# Altium schematic sheet TopLevel.SchDoc
size A3; DrawnBy: Fredrik Skavlem; SheetNumber: 1; SheetTotal: 8
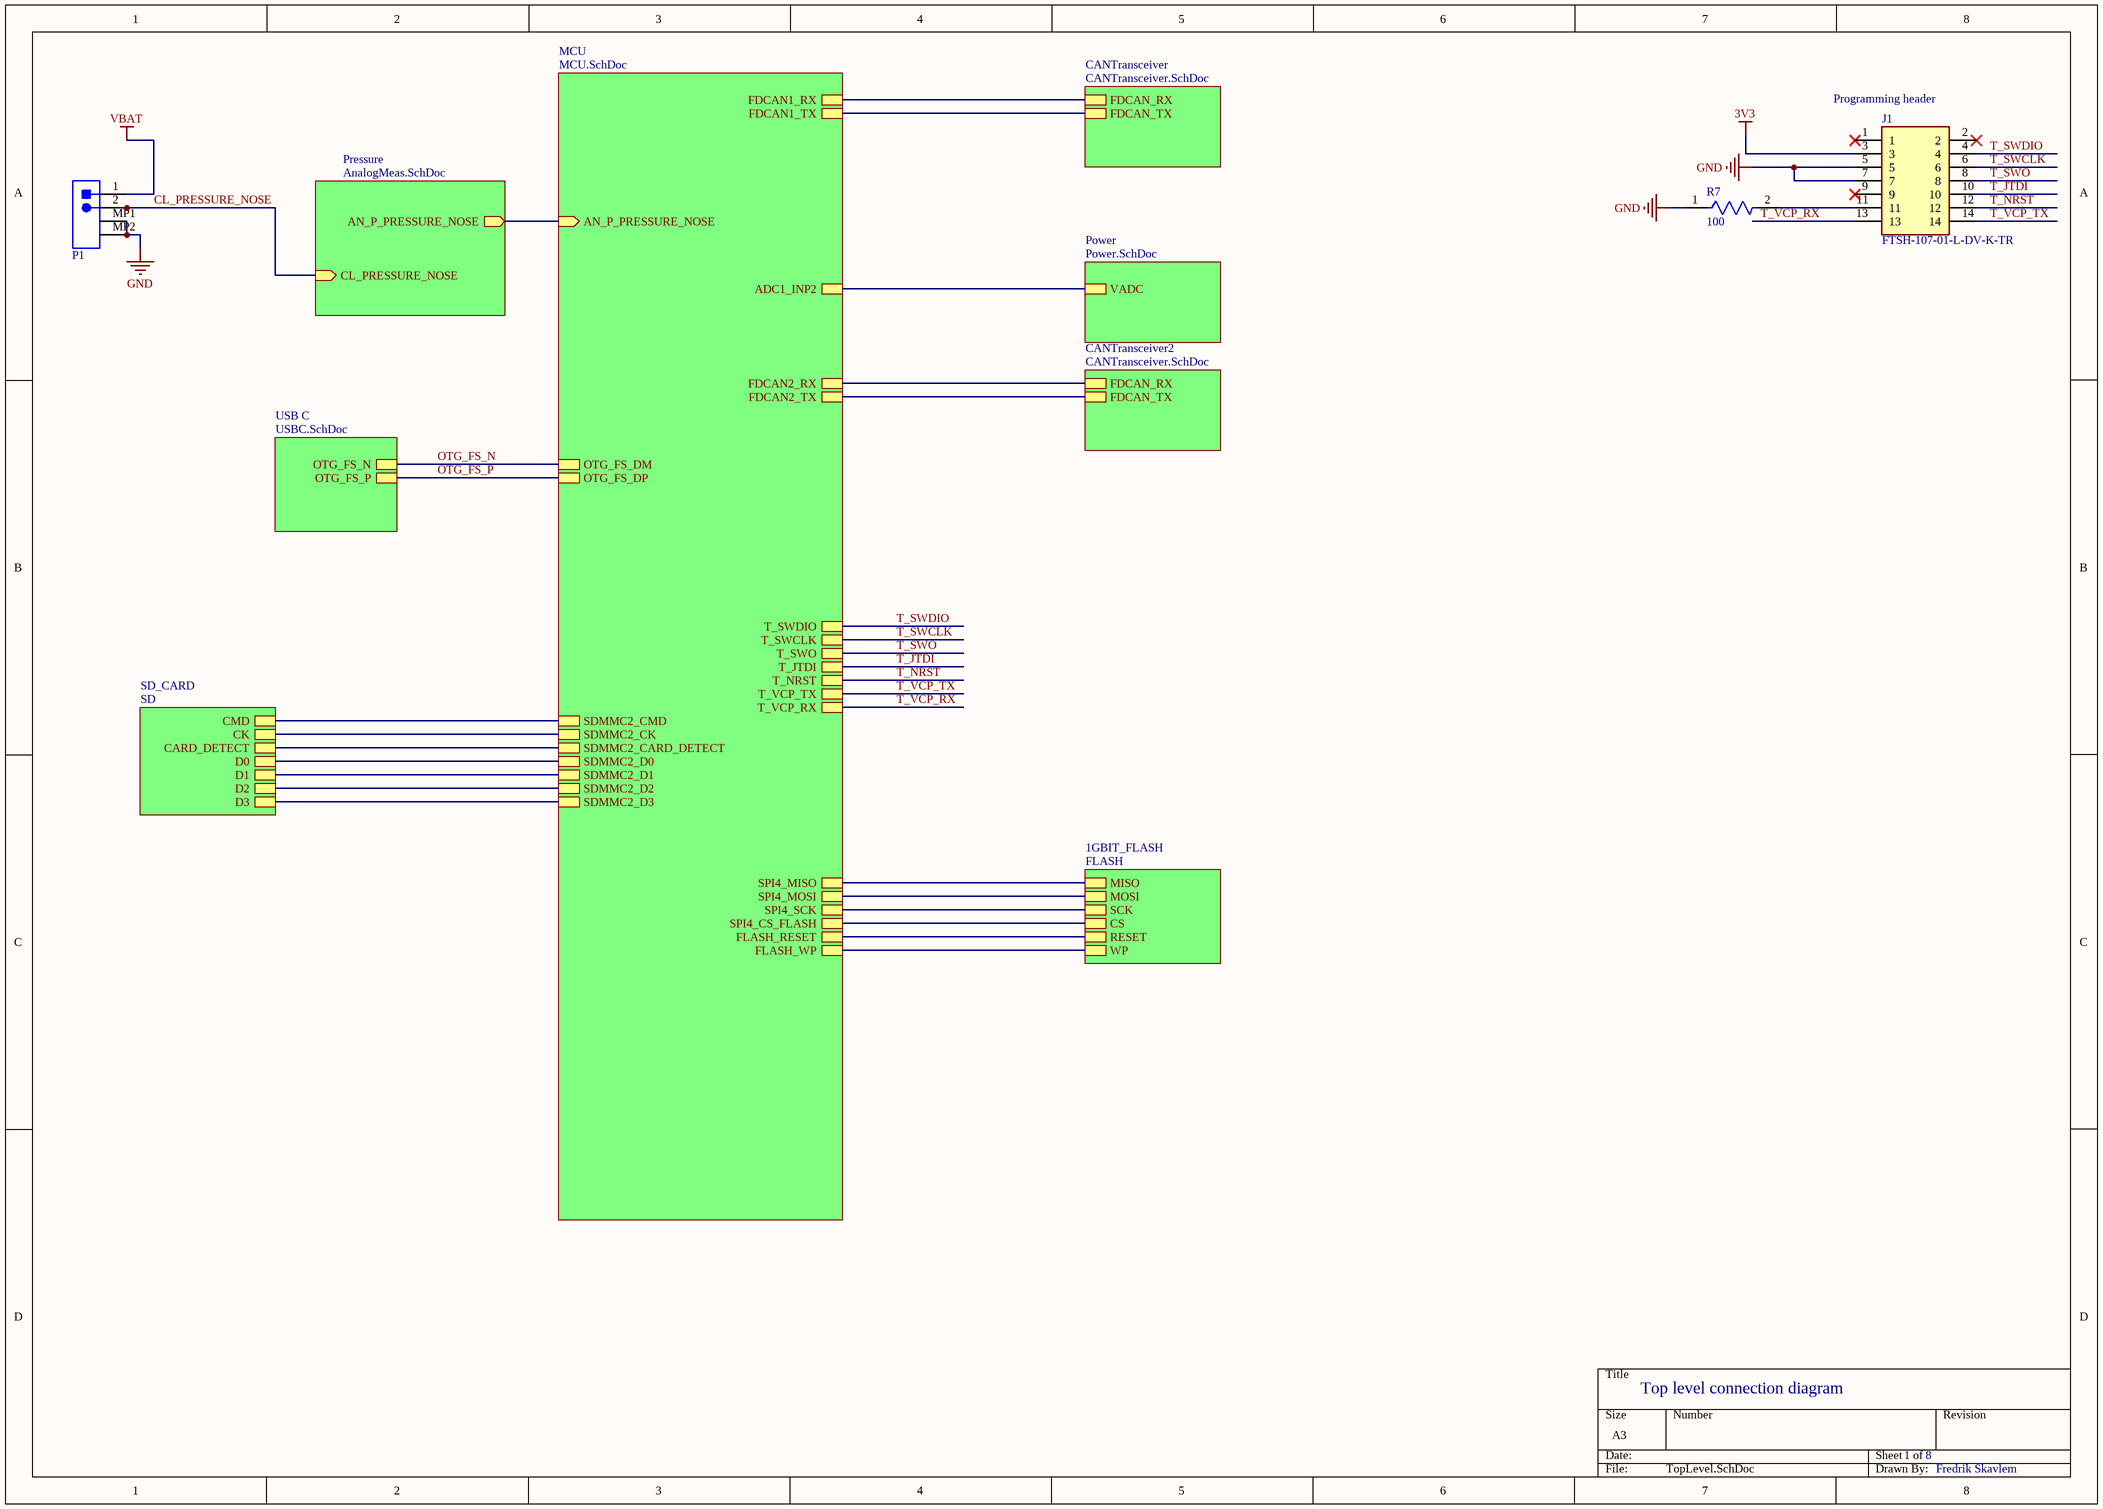
[diagram p0: TopLevel.SchDoc]

## Parts
J1  FTSH-107-01-L-DV-K-TR  [FTSH10701LDVKTR]
P1  S2B-PH-SM4-TB(LF)(SN)  [JST- S2B-PH-SM4-TB(LF)(SN)-2_V]  (value not drawn)
R7  100  [FP-RT0603-MFG]

## Sub-sheets
1GBIT_FLASH = FLASH: WP, RESET, CS, SCK, MOSI, MISO
CANTransceiver = CANTransceiver.SchDoc: FDCAN_RX, FDCAN_TX
CANTransceiver2 = CANTransceiver.SchDoc: FDCAN_RX, FDCAN_TX
MCU = MCU.SchDoc: FDCAN1_RX, FDCAN1_TX, T_SWDIO, T_SWCLK, T_SWO, T_JTDI, T_NRST, T_VCP_TX, T_VCP_RX, SPI4_MISO, SPI4_MOSI, SPI4_SCK, FLASH_RESET, SPI4_CS_FLASH, FLASH_WP, SDMMC2_CMD, SDMMC2_CK, SDMMC2_D0, SDMMC2_D1, SDMMC2_D2, SDMMC2_D3, SDMMC2_CARD_DETECT, ADC1_INP2, FDCAN2_RX, FDCAN2_TX, AN_P_PRESSURE_NOSE (in), OTG_FS_DM, OTG_FS_DP
Power = Power.SchDoc: VADC
Pressure = AnalogMeas.SchDoc: AN_P_PRESSURE_NOSE (out), CL_PRESSURE_NOSE (in)
SD_CARD = SD: CMD, CK, CARD_DETECT, D0, D1, D2, D3
USB C = USBC.SchDoc: OTG_FS_N, OTG_FS_P

## Nets
3V3: J1.3
GND: J1.5 J1.7 P1.MP1 P1.MP2 R7.1
VBAT: P1.1
CL_PRESSURE_NOSE: P1.2 ; sheet Pressure/CL_PRESSURE_NOSE
OTG_FS_N: sheet MCU/OTG_FS_DM, sheet USB C/OTG_FS_N
OTG_FS_P: sheet MCU/OTG_FS_DP, sheet USB C/OTG_FS_P
T_JTDI: J1.10 ; sheet MCU/T_JTDI
T_NRST: J1.12 ; sheet MCU/T_NRST
T_SWCLK: J1.6 ; sheet MCU/T_SWCLK
T_SWDIO: J1.4 ; sheet MCU/T_SWDIO
T_SWO: J1.8 ; sheet MCU/T_SWO
T_VCP_RX: J1.13 ; sheet MCU/T_VCP_RX
T_VCP_TX: J1.14 ; sheet MCU/T_VCP_TX
NetJ1_11: J1.11 R7.2
(unnamed): sheet MCU/FDCAN1_RX, sheet CANTransceiver/FDCAN_RX
(unnamed): sheet MCU/FDCAN1_TX, sheet CANTransceiver/FDCAN_TX
(unnamed): sheet MCU/SPI4_MISO, sheet 1GBIT_FLASH/MISO
(unnamed): sheet MCU/SPI4_MOSI, sheet 1GBIT_FLASH/MOSI
(unnamed): sheet MCU/SPI4_SCK, sheet 1GBIT_FLASH/SCK
(unnamed): sheet MCU/FLASH_RESET, sheet 1GBIT_FLASH/RESET
(unnamed): sheet MCU/SPI4_CS_FLASH, sheet 1GBIT_FLASH/CS
(unnamed): sheet MCU/FLASH_WP, sheet 1GBIT_FLASH/WP
(unnamed): sheet MCU/SDMMC2_CMD, sheet SD_CARD/CMD
(unnamed): sheet MCU/SDMMC2_CK, sheet SD_CARD/CK
(unnamed): sheet MCU/SDMMC2_D0, sheet SD_CARD/D0
(unnamed): sheet MCU/SDMMC2_D1, sheet SD_CARD/D1
(unnamed): sheet MCU/SDMMC2_D2, sheet SD_CARD/D2
(unnamed): sheet MCU/SDMMC2_D3, sheet SD_CARD/D3
(unnamed): sheet MCU/SDMMC2_CARD_DETECT, sheet SD_CARD/CARD_DETECT
(unnamed): sheet MCU/ADC1_INP2, sheet Power/VADC
(unnamed): sheet MCU/FDCAN2_RX, sheet CANTransceiver2/FDCAN_RX
(unnamed): sheet MCU/FDCAN2_TX, sheet CANTransceiver2/FDCAN_TX
(unnamed): sheet MCU/AN_P_PRESSURE_NOSE, sheet Pressure/AN_P_PRESSURE_NOSE

Not connected (* = marked no-connect by the designer): J1 1* 2* 9*

## Notes on the sheet
- (near J1) Programming header
- Top level connection diagram
- 1
- 8
- Fredrik Skavlem

## Library data of the parts
J1 = FTSH-107-01-L-DV-K-TR: Connector; Manufacturer_Name: SAMTEC; Datasheet Link: https://suddendocs.samtec.com/prints/ftsh-1xx-xx-xxx-dv-xxx-xxx-x-xx-mkt.pdf?_gl=1*mdiyn1*_ga*MTcyMTUxMTIwMy4xNzEyMDQxMTc2*_ga_3KFNZC07WW*MTcxMjEzMDIxOS4yLjEuMTcxMjEzMDI1NC4yNS4wLjA.; Height: 6.25mm; Manufacturer_Part_Number: FTSH-107-01-L-DV-K-TR; Mouser Part Number: 200-FTSH10701LDVKTR; Mouser Price/Stock: https://www.mouser.co.uk/ProductDetail/Samtec/FTSH-107-01-L-DV-K-TR?qs=%252BZP6%2F%252BtExtDlh0wyxE013Q%3D%3D; Arrow Part Number: FTSH-107-01-L-DV-K-TR; Arrow Price/Stock: https://www.arrow.com/en/products/ftsh-107-01-l-dv-k-tr/samtec?utm_currency=USD&region=nac
P1 = CMP-002-00031-2: Male Header, Pitch 2 mm, 1 x 2 Position, Height 5.5 mm, -25 to 85 degC, RoHS, Tape and Reel; Manufacturer: JST; Package Reference: S2B-PH-SM4-TB(LF)(SN)-2; Mounting Technology: SM; Manufacturer URL: http://www.jst.com/home2.html; Package Description: Male Header, Pitch 2 mm, 1 x 2 Position, Height 5.5 mm; Max Operating Temperature: 85°C; Case/Package: S2B-PH-SM4-TB(LF)(SN)-2; Datasheet URL: http://www.jst-mfg.com/product/pdf/eng/ePH.pdf; Connector Type: Header; RoHS Compliant: Unknown; Datasheet Version: Dec-12; Gender: Male; Min Operating Temperature: -25°C
R7 = CMP-03412-030646-1: RT0603 100Ω 0.1W 50 ppm/°C 1.00% RT0603FRE07100RL; Manufacturer: Yageo; Manufacturer Part Number: RT0603FRE10100RL; Tolerance: 0.01; Voltage Rating: 75V; Power Rating: 0.1W; Octopart: https://octopart.com/rt0603fre10100rl-yageo-22252409; Footprint Url: http://www.yageo.com/exep/pages/download/literatures/PYu-R_Mount_10.pdf; RoHS: TRUE; Temperature Range High: +155°C; Resistance: 100Ω; ComponentLink2Description: Datasheet; Device Class L1: Passive Components; Temperature Range Low: -55°C; Device Class L3: Chip SMD Resistors; Composition: Thin Film; Package: RT0603; Lead Free: Yes; Device Class L2: Resistors; Temperature: -55°C to +155°C; ComponentLink2URL: http://www.yageo.com/documents/recent/PYu-RT_1-to-0.01_RoHS_L_9.pdf; Value: 100Ω; Series: RT; Ipc Land Pattern Name: RESC16080X45; Automotive: No; Category: Res; Temperature Coefficient: 50 ppm/°C; Height: 0.55mm